# EAGLE schematic Team3_Schematic_v4 (EAGLE 9.7.0)
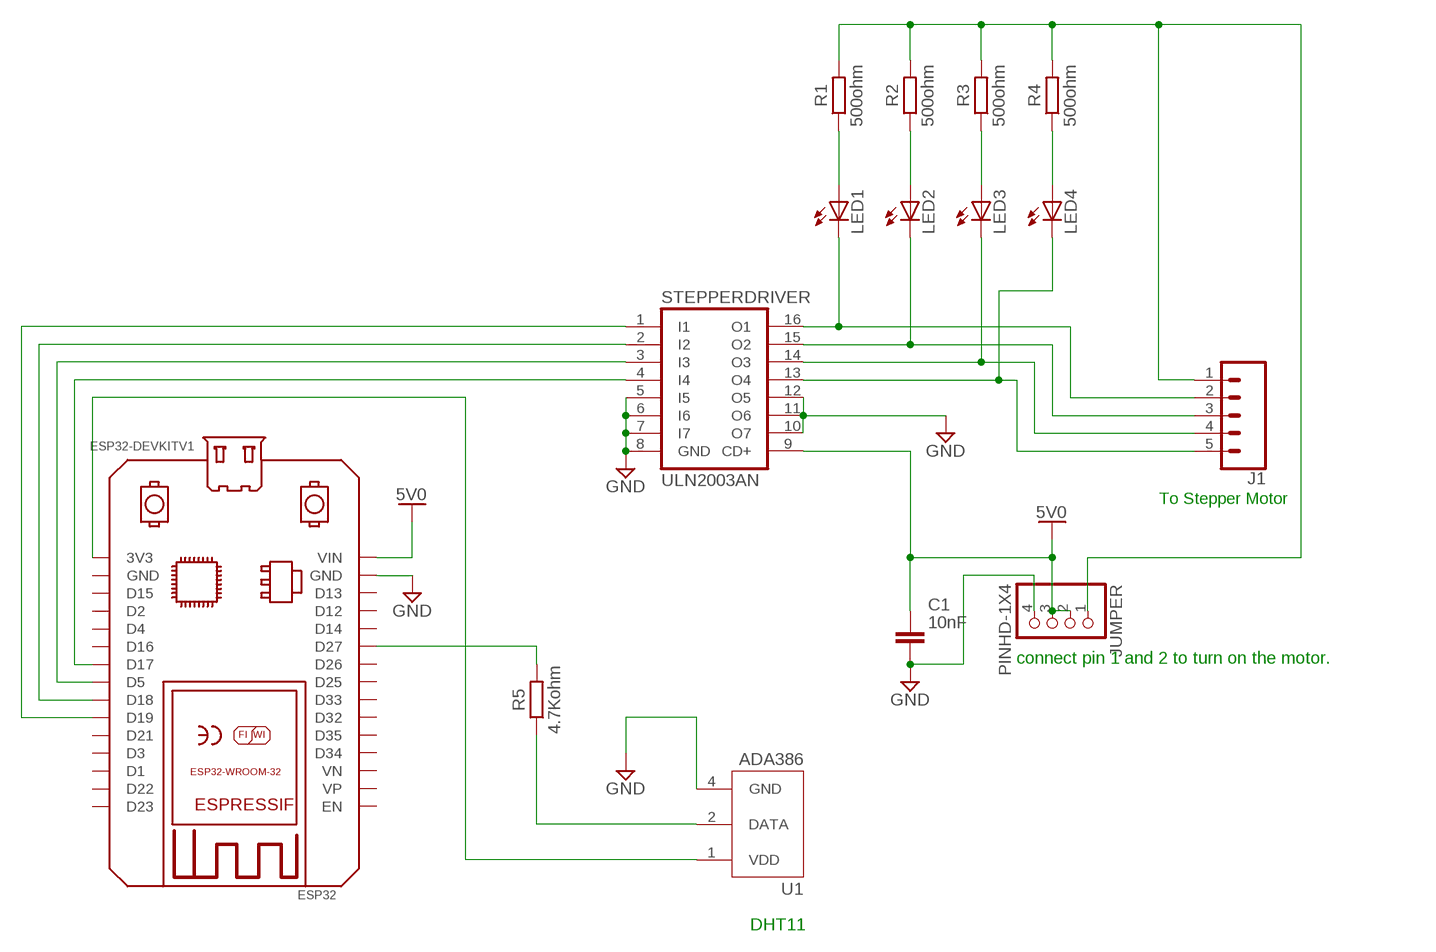
[diagram p0: schematic, sheet 1]

## Parts
C1  10nF  C_CHIP-0805(2012-METRIC)  [CAPC2012X110]
ESP32  ESP32DEVKITV1  [ESP32-DEVKITV1]
J1  CONN_05JST-VERT  [JST-5-PTH-VERT]
JUMPER  PINHD-1X4  [1X04]
LED1  LED5MM  [LED5MM]
LED2  LED5MM  [LED5MM]
LED3  LED5MM  [LED5MM]
LED4  LED5MM  [LED5MM]
R1  500ohm  R_CHIP-1206(3216-METRIC)  [RESC3216X70]
R2  500ohm  R_CHIP-1206(3216-METRIC)  [RESC3216X70]
R3  500ohm  R_CHIP-1206(3216-METRIC)  [RESC3216X70]
R4  500ohm  R_CHIP-1206(3216-METRIC)  [RESC3216X70]
R5  4.7Kohm  R_CHIP-1206(3216-METRIC)  [RESC3216X70]
STEPPERDRIVER  ULN2003AN  [DIL16]
U1  ADA386  [XDCR_ADA386]

## Nets
5V0: C1.1 ESP32.VIN JUMPER.2 JUMPER.3 STEPPERDRIVER.9(CD+)
GND: C1.2 ESP32.GND JUMPER.4 STEPPERDRIVER.5(I5) STEPPERDRIVER.6(I6) STEPPERDRIVER.7(I7) STEPPERDRIVER.8(GND) STEPPERDRIVER.10(O7) STEPPERDRIVER.11(O6) STEPPERDRIVER.12(O5) U1.4(GND)
N$1: R5.1 U1.2(DATA)
N$2: ESP32.D27 R5.2
N$3: ESP32.D19 STEPPERDRIVER.1(I1)
N$4: ESP32.D18 STEPPERDRIVER.2(I2)
N$5: ESP32.D5 STEPPERDRIVER.3(I3)
N$6: ESP32.D17 STEPPERDRIVER.4(I4)
N$7: J1.2 LED1.K(C) STEPPERDRIVER.16(O1)
N$8: J1.3 LED2.K(C) STEPPERDRIVER.15(O2)
N$9: J1.4 LED3.K(C) STEPPERDRIVER.14(O3)
N$10: J1.5 LED4.K(C) STEPPERDRIVER.13(O4)
N$11: J1.1 JUMPER.1 R1.2 R2.2 R3.2 R4.2
N$12: LED1.A R1.1
N$13: LED4.A R4.1
N$14: LED3.A R3.1
N$15: LED2.A R2.1
N$16: ESP32.3V3 U1.1(VDD)
Unconnected: ESP32.D1 ESP32.D2 ESP32.D3 ESP32.D4 ESP32.D12 ESP32.D13 ESP32.D14 ESP32.D15 ESP32.D16 ESP32.D21 ESP32.D22 ESP32.D23 ESP32.D25 ESP32.D26 ESP32.D32 ESP32.D33 ESP32.D34 ESP32.D35 ESP32.EN ESP32.GND@1(GND) ESP32.VN ESP32.VP

## Notes on the sheet
- To Stepper Motor
- connect pin 1 and 2 to turn on the motor.
- DHT11

## Library data of the parts
C1 = Capacitor:C: Capacitor - Generic; CATEGORY: Capacitor
ESP32 = ESP32-DEVKITV1:ESP32DEVKITV1: https://github.com/shridattdudhat
J1 = SparkFun-Connectors:CONN_05: Multi connection point. Often used as Generic Header-pin footprint for 0.1 inch spaced/style header connections On any of the 0.1 inch spaced packages, you can populate with these: Break Away Headers - Straight <https://www.sparkfun.com/products/116> (PRT-00116) Break Away Male Headers - Right Angle <https://www.sparkfun.com/products/553> (PRT-00553) Female Headers <https://www.sparkfun.com/products/115> (PRT-00115) Break Away Headers - Machine Pin <https://www.sparkfun.com/products/117> (PRT-00117) Break Away Female Headers - Swiss Machine Pin <https://www.sparkfun.com/products/743> (PRT-00743) For SCREWTERMINALS and SPRING TERMINALS visit here: Screw Terimnals on SparkFun.com <https://www.sparkfun.com/search/results?term=Screw+Terminals> (5mm/3.5mm/2.54mm spacing) This device is also useful as a general connection point to wire up your design to another part of your project. Our various solder wires solder well into these plated through hole pads. Hook-Up Wire - Assortment (Stranded, 22 AWG) <https://www.sparkfun.com/products/11375> (PRT-11375) Hook-Up Wire - Assortment (Solid Core, 22 AWG) <https://www.sparkfun.com/products/11367> (PRT-11367) View the entire wire category on our website here <https://www.sparkfun.com/categories/141> Special notes: Molex polarized connector foot print use with SKU : PRT-08231 with associated crimp pins and housings. 1MM SMD Version SKU: PRT-10208
JUMPER = Connector:PINHD-1X4: PIN HEADER; CATEGORY: CONNECTOR; SUB-CATEGORY: PIN-HEADER
LED1-LED4 = adafruit:LED: LED OSRAM: - CHIPLED LG R971, LG N971, LY N971, LG Q971, LY Q971, LO R971, LY R971 LH N974, LH R974 LS Q976, LO Q976, LY Q976 LO Q996 - Hyper CHIPLED LW Q18S LB Q993, LB Q99A, LB R99A - SideLED LS A670, LO A670, LY A670, LG A670, LP A670 LB A673, LV A673, LT A673, LW A673 LH A674 LY A675 LS A676, LA A676, LO A676, LY A676, LW A676 LS A679, LY A679, LG A679 - Hyper Micro SIDELED® LS Y876, LA Y876, LO Y876, LY Y876 LT Y87S - SmartLED LW L88C, LW L88S LB L89C, LB L89S, LG L890 LS L89K, LO L89K, LY L89K LS L896, LA L896, LO L896, LY L896 - TOPLED LS T670, LO T670, LY T670, LG T670, LP T670 LSG T670, LSP T670, LSY T670, LOP T670, LYG T670 LG T671, LOG T671, LSG T671 LB T673, LV T673, LT T673, LW T673 LH T674 LS T676, LA T676, LO T676, LY T676, LB T676, LH T676, LSB T676, LW T676 LB T67C, LV T67C, LT T67C, LS T67K, LO T67K, LY T67K, LW E67C LS E67B, LA E67B, LO E67B, LY E67B, LB E67C, LV E67C, LT E67C LW T67C LS T679, LY T679, LG T679 LS T770, LO T770, LY T770, LG T770, LP T770 LB T773, LV T773, LT T773, LW T773 LH T774 LS E675, LA E675, LY E675, LS T675 LS T776, LA T776, LO T776, LY T776, LB T776 LHGB T686 LT T68C, LB T68C - Hyper Mini TOPLED® LB M676 - Mini TOPLED Santana® LG M470 LS M47K, LO M47K, LY M47K Source: http://www.osram.convergy.de/
R1-R5 = Resistor:R: Resistor Fixed - Generic; CATEGORY: Resistor; SUB-CATEGORY: Fixed
STEPPERDRIVER = uln-udn:ULN2003A: DRIVER ARRAY
U1 = ADA386:ADA386: DHT11 basic temperature-humidity sensor + extras; MANUFACTURER: Adafruit; MAXIMUM_PACKAGE_HEIGHT: 15.5mm; PARTREV: N/A; STANDARD: Manufacturer Recommendations